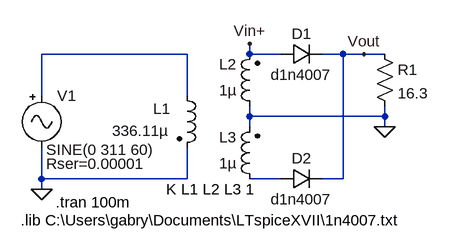
[diagram p0: schematic retificador.asc]
retificador.asc, the LTspice schematic file:
Version 4
SHEET 1 880 680
WIRE 304 64 80 64
WIRE 400 64 400 48
WIRE 448 64 400 64
WIRE 544 64 512 64
WIRE 576 64 544 64
WIRE 608 64 576 64
WIRE 80 128 80 64
WIRE 304 128 304 64
WIRE 400 160 400 144
WIRE 608 160 608 144
WIRE 608 160 400 160
WIRE 400 176 400 160
WIRE 608 176 608 160
WIRE 80 256 80 208
WIRE 304 256 304 208
WIRE 304 256 80 256
WIRE 448 256 400 256
WIRE 544 256 544 64
WIRE 544 256 512 256
WIRE 80 272 80 256
FLAG 608 176 0
FLAG 400 48 Vin+
FLAG 80 272 0
FLAG 576 64 Vout
SYMBOL Misc\\signal 80 112 R0
WINDOW 3 7 99 Left 2
WINDOW 123 0 0 Left 0
WINDOW 39 7 121 Left 2
SYMATTR InstName V1
SYMATTR Value SINE(0 311 60)
SYMATTR SpiceLine Rser=0.00001
SYMBOL ind2 288 112 R0
WINDOW 0 -36 36 Left 2
WINDOW 3 -99 70 Left 2
SYMATTR InstName L1
SYMATTR Value 336.11µ
SYMATTR Type ind
SYMBOL ind2 416 160 R180
WINDOW 0 36 80 Left 2
WINDOW 3 36 40 Left 2
SYMATTR InstName L2
SYMATTR Value 1µ
SYMATTR Type ind
SYMBOL ind2 416 272 R180
WINDOW 0 36 80 Left 2
WINDOW 3 36 40 Left 2
SYMATTR InstName L3
SYMATTR Value 1µ
SYMATTR Type ind
SYMBOL diode 448 80 R270
WINDOW 0 32 32 VTop 2
WINDOW 3 0 32 VBottom 2
SYMATTR InstName D1
SYMATTR Value d1n4007
SYMBOL diode 448 272 R270
WINDOW 0 32 32 VTop 2
WINDOW 3 0 32 VBottom 2
SYMATTR InstName D2
SYMATTR Value d1n4007
SYMBOL res 592 48 R0
SYMATTR InstName R1
SYMATTR Value 16.3
TEXT 48 320 Left 2 !.lib C:\\Users\\gabry\\Documents\\LTspiceXVII\\1n4007.txt
TEXT 272 272 Left 2 !K L1 L2 L3 1
TEXT 102 292 Left 2 !.tran 100m

The netlist it stands for:
* retificador.asc
V1 N001 0 SINE(0 311 60) Rser=0.00001
L1 N001 0 336.11µ
L2 0 Vin+ 1µ
L3 N002 0 1µ
D1 Vin+ Vout d1n4007
D2 N002 Vout d1n4007
R1 Vout 0 16.3
.model D D
.lib standard.dio
.lib C:\Users\gabry\Documents\LTspiceXVII\1n4007.txt
K L1 L2 L3 1
.tran 100m
.backanno
.end

* Results of the author's LTspice run, read from the files saved beside the schematic
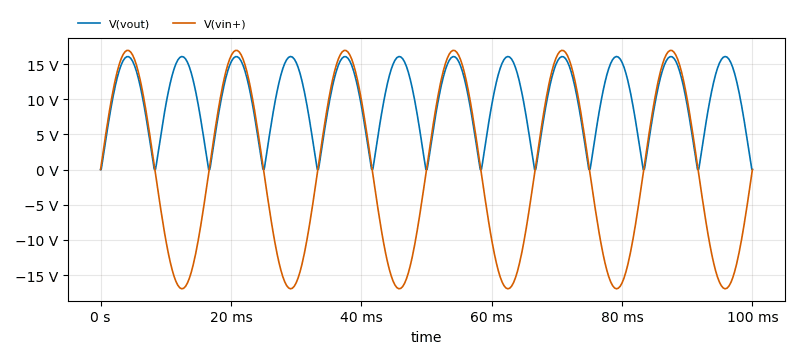
[diagram p1: Transient Analysis of retificador.asc, plotted from the saved traces]
* Transient Analysis, 1 run:
*   V(vout): min -3.109 mV, max 16.07 V, average 9.961 V, rms 11.22 V, last 0 V
*   V(vin+): min -16.96 V, max 16.95 V, average -1.384 mV, rms 11.99 V, last 3.977 µV